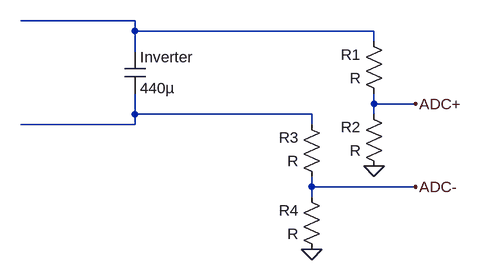
[diagram p0: schematic Voltage Sensing Schematic.asc]
Voltage Sensing Schematic.asc, the LTspice schematic file:
Version 4
SHEET 1 880 680
WIRE -16 96 -192 96
WIRE -16 112 -16 96
WIRE 352 112 -16 112
WIRE 352 128 352 112
WIRE -16 144 -16 112
WIRE 352 224 352 208
WIRE 416 224 352 224
WIRE -16 240 -16 208
WIRE 256 240 -16 240
WIRE 352 240 352 224
WIRE -16 256 -16 240
WIRE -16 256 -192 256
WIRE 256 256 256 240
WIRE 256 352 256 336
WIRE 416 352 256 352
WIRE 256 368 256 352
FLAG 352 320 0
FLAG 256 448 0
FLAG 416 224 ADC+
FLAG 416 352 ADC-
SYMBOL cap -32 144 R0
SYMATTR InstName Inverter
SYMATTR Value 440µ
SYMBOL res 368 224 R180
WINDOW 0 36 76 Left 2
WINDOW 3 36 40 Left 2
SYMATTR InstName R1
SYMBOL res 368 336 R180
WINDOW 0 36 76 Left 2
WINDOW 3 36 40 Left 2
SYMATTR InstName R2
SYMBOL res 272 352 R180
WINDOW 0 36 76 Left 2
WINDOW 3 36 40 Left 2
SYMATTR InstName R3
SYMBOL res 272 464 R180
WINDOW 0 36 76 Left 2
WINDOW 3 36 40 Left 2
SYMATTR InstName R4

The netlist it stands for:
* Voltage Sensing Schematic.asc
C§Inverter N001 N002 440µ
R1 ADC+ N001 R
R2 0 ADC+ R
R3 ADC- N002 R
R4 0 ADC- R
.backanno
.end